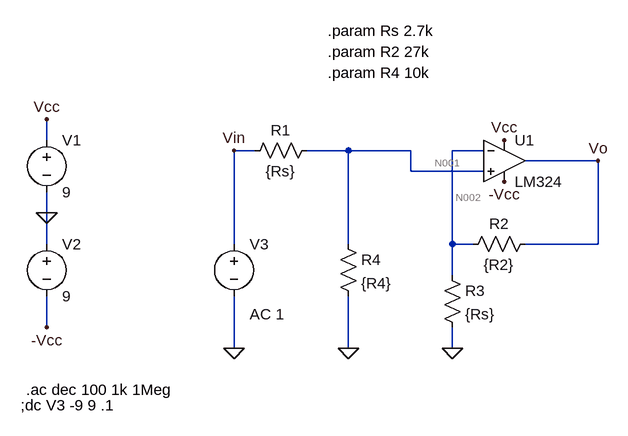
[diagram p0: schematic No_inversor_Caso1.asc]
* No_inversor_Caso1.asc
* U1: LM324 (symbol sympropio\LM324 not available, pins judged from their places): In+=N001 In-=N002 V+=Vcc V-=-Vcc OUT=Vo
V1 Vcc 0 9
V2 0 -Vcc 9
V3 Vin 0 AC 1
R1 N001 Vin {Rs}
R4 N001 0 {R4}
R3 N002 0 {Rs}
R2 Vo N002 {R2}
.param Rs 2.7k
.param R2 27k
.param R4 10k
.ac dec 100 1k 1Meg
;dc V3 -9 9 .1
.backanno
.end

* Results of the author's LTspice run, read from the files saved beside the schematic
* Operating Point, zero values left out:
*   V(vo) = -442.7 µV
*   V(-vcc) = -9 V
*   V(vcc) = 9 V
*   V(n002) = 8.704 µV
*   V(n001) = 42.36 µV
*   I(R2) = -16.72 nA
*   I(R3) = 3.224 nA
*   I(R4) = 4.236 nA
*   I(R1) = 15.69 nA
*   I(V3) = 15.69 nA
*   I(V2) = -603.8 µA
*   I(V1) = -603.9 µA
*   Ix(u1:1) = -19.92 nA
*   Ix(u1:2) = -19.94 nA
*   Ix(u1:3) = 603.9 µA
*   Ix(u1:4) = -603.8 µA
*   Ix(u1:5) = 16.72 nA
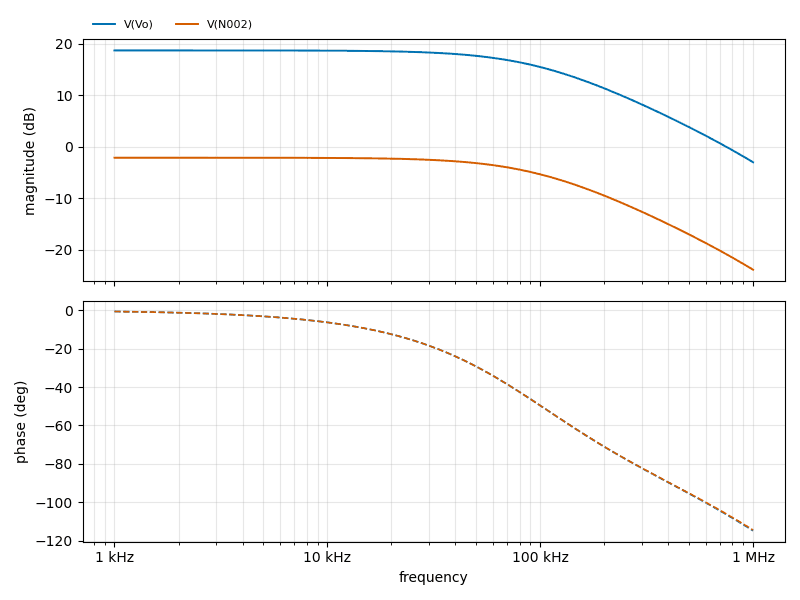
[diagram p1: AC Analysis of No_inversor_Caso1.asc, plotted from the saved traces]
* AC Analysis, 1 run:
*   V(Vo): 18.75 dB at 1 kHz, -2.96 dB at 1 MHz, peak 18.75 dB at 1 kHz, 3 dB below the peak at 95.28 kHz
*   V(N002): -2.08 dB at 1 kHz, -23.82 dB at 1 MHz, peak -2.08 dB at 1 kHz, 3 dB below the peak at 95.27 kHz